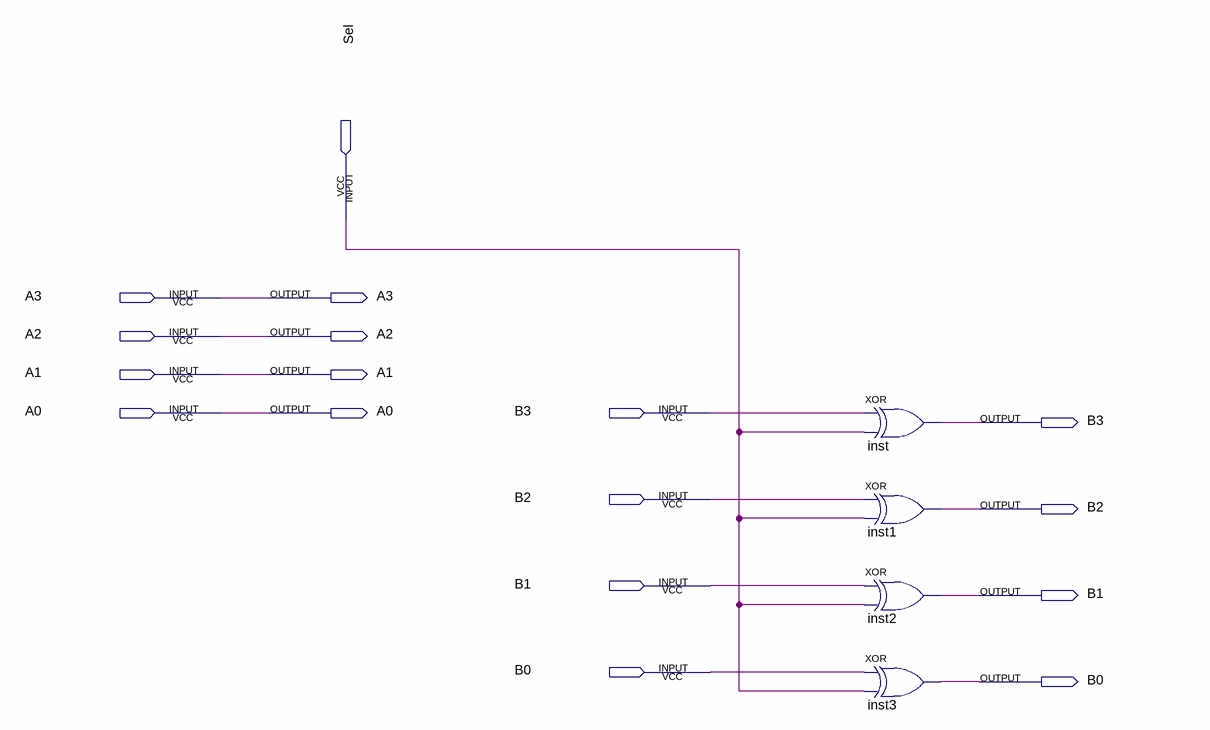
[diagram p0: schematic sheet]
// Quartus schematic Select SumSub.bdf as structural Verilog: 4 symbols, 17 pins
module \Select_SumSub  (
  input  Sel,
  inout  A3,
  inout  A2,
  inout  A1,
  inout  A0,
  inout  B3,
  inout  B2,
  inout  B1,
  inout  B0
);

  xor inst (B3, B3, Sel);
  xor inst1 (B2, B2, Sel);
  xor inst2 (B1, B1, Sel);
  xor inst3 (B0, B0, Sel);
endmodule
